# EAGLE design Protocell_module (EAGLE 7.1.0)
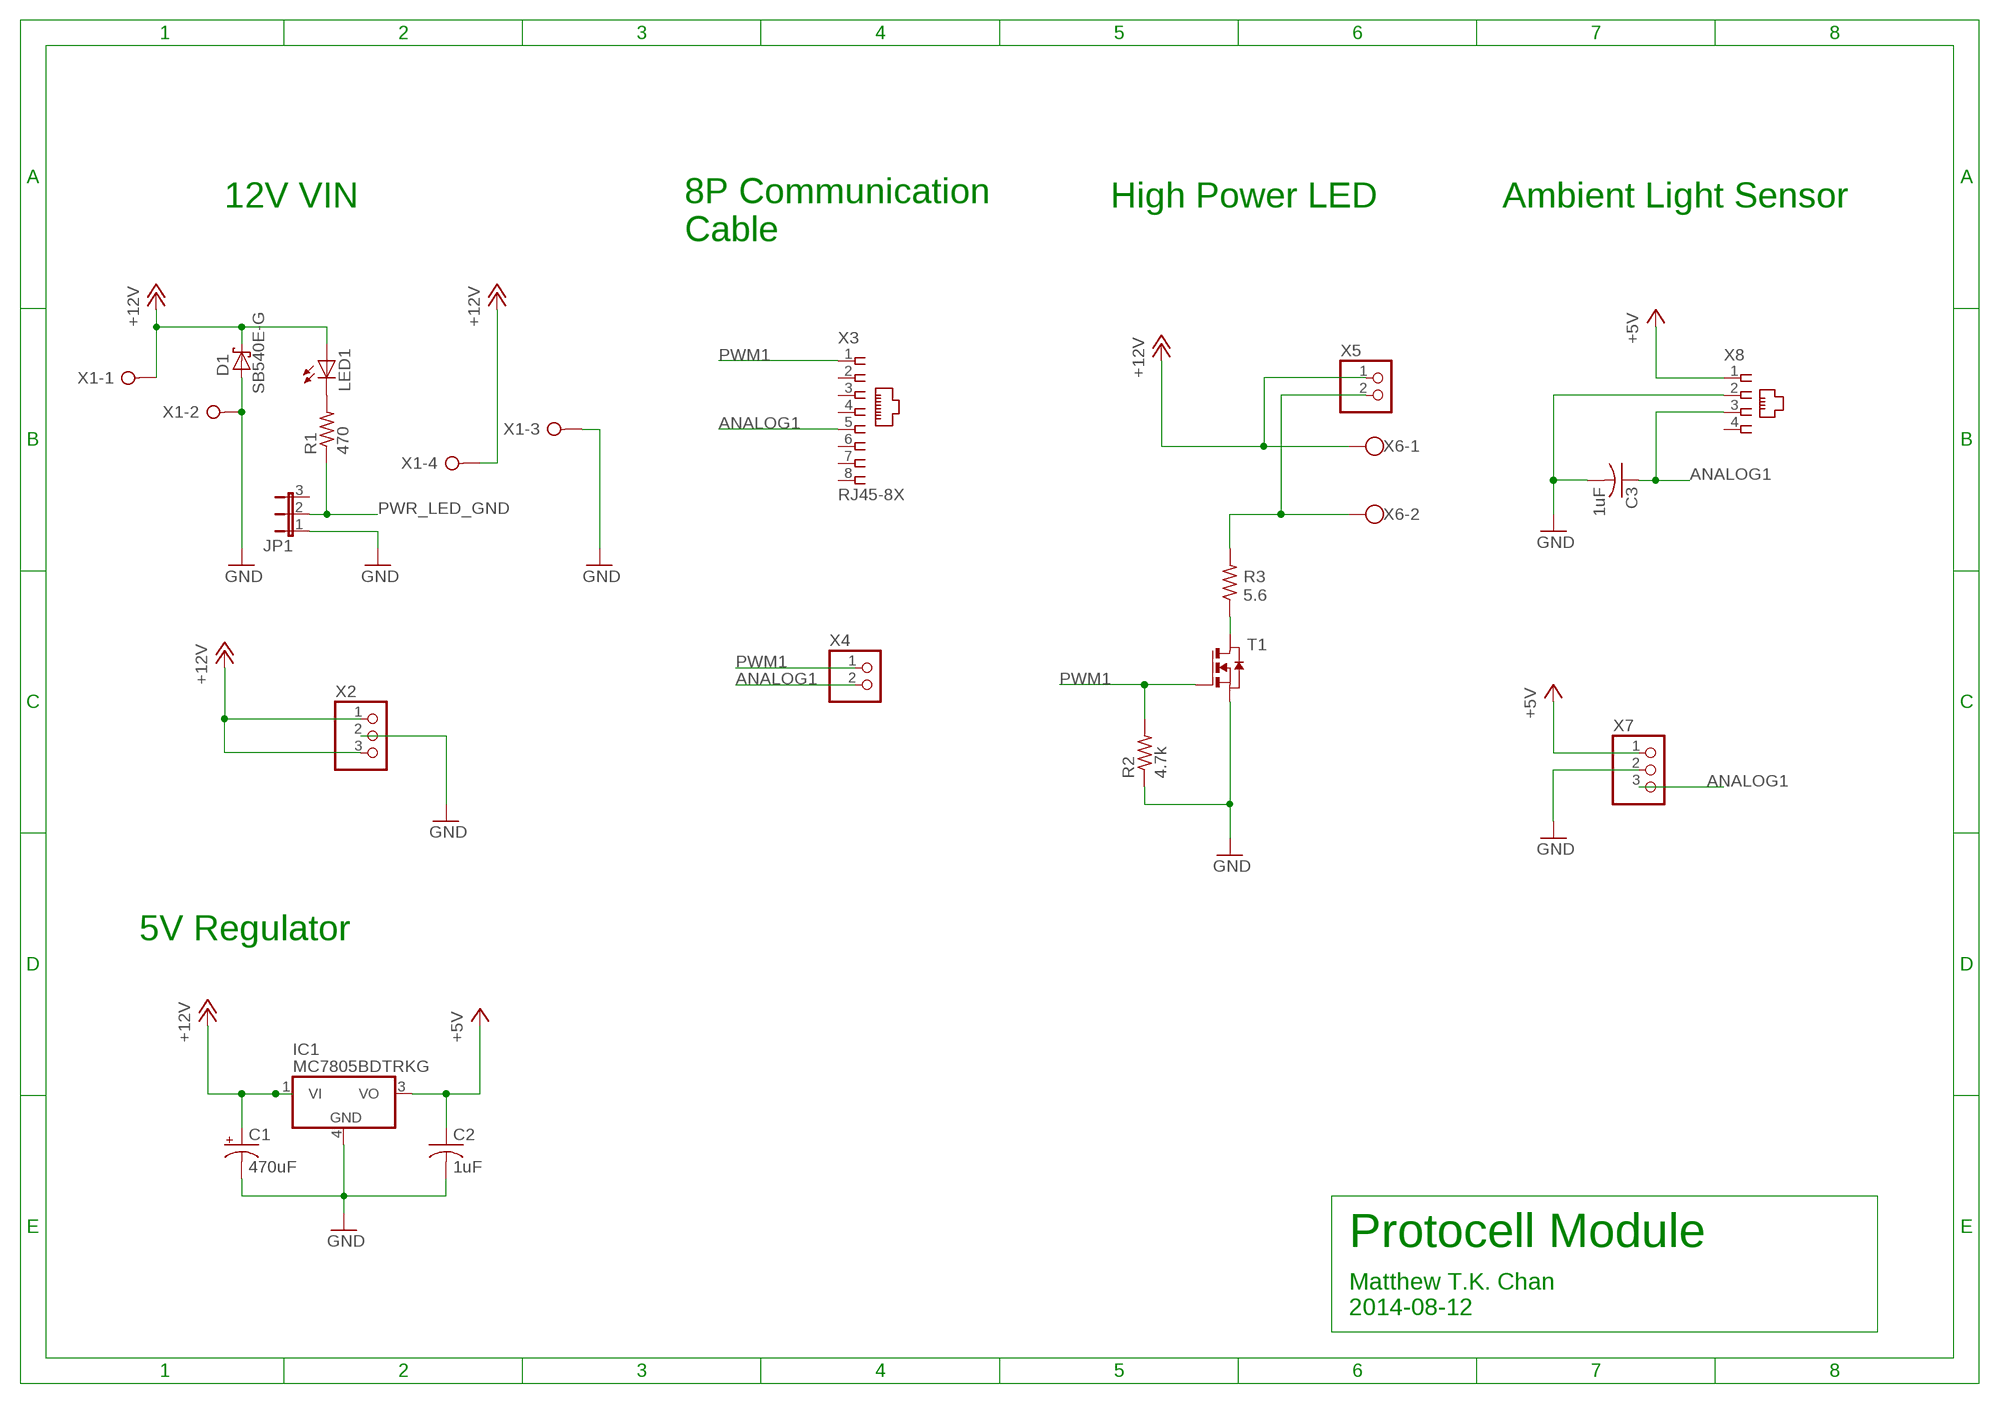
[diagram p0: schematic, sheet 1]

## Parts
C1  470uF  CPOL-USE5-10.5  [E5-10,5]
C2  1uF  C-USC0603  [C0603]
C3  1uF  C-USC0603  [C0603]
D1  SB540E-G  [DO201T15]
IC1  MC7805BDTRKG  [DPACK_3]
JP1  JP2E  [JP2]
LED1  LEDSML1206  [SML1206]
R1  470  R-US_R0603  [R0603]
R2  4.7k  R-US_R0603  [R0603]
R3  5.6  SQP500JB-5R6  [YAGEO_SQP500JB]
T1  NTD5867NLT4G  [DPACK]
X1  W237-04P  [W237-4P]
X2  PINHD-1X3/90  [1X03/90]
X3  RJ45-8X  [RJ45-NO-SHIELD]
X4  PINHD-1X2/90  [1X02/90]
X5  PINHD-1X2/90  [1X02/90]
X6  W237-102  [W237-102]
X7  PINHD-1X3/90  [1X03/90]
X8  558872-1  [558872-1]

## Nets
+5V: C2.1 IC1.3(VO) X7.1 X8.1
+12V: C1.+ D1.C IC1.1(VI) LED1.A X1.1 X1.4 X2.1 X2.3 X5.1 X6.1
ANALOG1: C3.1 X3.5 X4.2 X7.3 X8.3
GND: C1.- C2.2 C3.2 D1.A IC1.4(GND) JP1.1 R2.1 T1.3(S) X1.2 X1.3 X2.2 X7.2 X8.2
N$1: R3.1 T1.2(D)
N$3: R3.2 X5.2 X6.2
N$10: LED1.C R1.2
PWM1: R2.2 T1.1(G) X3.1 X4.1
PWR_LED_GND: JP1.2 R1.1
Unconnected: JP1.3 X3.2 X3.3 X3.4 X3.6 X3.7 X3.8 X8.4

## Notes on the sheet
- 12V VIN | High Power LED | Ambient Light Sensor
- 8P Communication 
  Cable
- 5V Regulator
- Protocell Module
- Matthew T.K. Chan
  2014-08-12

## Library data of the parts
C1 = rcl:CPOL-US: POLARIZED CAPACITOR, American symbol
C2 C3 = rcl:C-US: CAPACITOR, American symbol
D1 = CBLA_Test_bed_Library:SB540E-G: SCHOTTKY BARRIER RECTIFIER 3.0 AMPERES 20, 30, 40 VOLT Source: MBRS340T3-D.pdf
IC1 = CBLA_Test_bed_Library:MC78: 1A Positive Voltage Regulators Source: Data sheet <http://www.onsemi.com/pub_link/Collateral/MC7800-D.PDF>
JP1 = jumper:JP2E: JUMPER
LED1 = led:LED: LED OSRAM: - CHIPLED LG R971, LG N971, LY N971, LG Q971, LY Q971, LO R971, LY R971 LH N974, LH R974 LS Q976, LO Q976, LY Q976 LO Q996 - Hyper CHIPLED LW Q18S LB Q993, LB Q99A, LB R99A - SideLED LS A670, LO A670, LY A670, LG A670, LP A670 LB A673, LV A673, LT A673, LW A673 LH A674 LY A675 LS A676, LA A676, LO A676, LY A676, LW A676 LS A679, LY A679, LG A679 - Hyper Micro SIDELED® LS Y876, LA Y876, LO Y876, LY Y876 LT Y87S - SmartLED LW L88C, LW L88S LB L89C, LB L89S, LG L890 LS L89K, LO L89K, LY L89K LS L896, LA L896, LO L896, LY L896 - TOPLED LS T670, LO T670, LY T670, LG T670, LP T670 LSG T670, LSP T670, LSY T670, LOP T670, LYG T670 LG T671, LOG T671, LSG T671 LB T673, LV T673, LT T673, LW T673 LH T674 LS T676, LA T676, LO T676, LY T676, LB T676, LH T676, LSB T676, LW T676 LB T67C, LV T67C, LT T67C, LS T67K, LO T67K, LY T67K, LW E67C LS E67B, LA E67B, LO E67B, LY E67B, LB E67C, LV E67C, LT E67C LW T67C LS T679, LY T679, LG T679 LS T770, LO T770, LY T770, LG T770, LP T770 LB T773, LV T773, LT T773, LW T773 LH T774 LS E675, LA E675, LY E675, LS T675 LS T776, LA T776, LO T776, LY T776, LB T776 LHGB T686 LT T68C, LB T68C - Hyper Mini TOPLED® LB M676 - Mini TOPLED Santana® LG M470 LS M47K, LO M47K, LY M47K Source: http://www.osram.convergy.de LUXEON: - LUMILED® LXK2-PW12-R00, LXK2-PW12-S00, LXK2-PW14-U00, LXK2-PW14-V00 LXK2-PM12-R00, LXK2-PM12-S00, LXK2-PM14-U00 LXK2-PE12-Q00, LXK2-PE12-R00, LXK2-PE12-S00, LXK2-PE14-T00, LXK2-PE14-U00 LXK2-PB12-K00, LXK2-PB12-L00, LXK2-PB12-M00, LXK2-PB14-N00, LXK2-PB14-P00, LXK2-PB14-Q00 LXK2-PR12-L00, LXK2-PR12-M00, LXK2-PR14-Q00, LXK2-PR14-R00 LXK2-PD12-Q00, LXK2-PD12-R00, LXK2-PD12-S00 LXK2-PH12-R00, LXK2-PH12-S00 LXK2-PL12-P00, LXK2-PL12-Q00, LXK2-PL12-R00 Source: www.luxeon.com KINGBRIGHT: KA-3528ASYC Source: www.kingbright.com
R1 R2 = CBLA_Test_bed_Library:R-US_: RESISTOR, American symbol
R3 = CBLA_Test_bed_Library:SQP500
T1 = CBLA_Test_bed_Library:NTD5867NL: MOS FET
X1 = con-wago-508:W237-04P: WAGO SREW CLAMP; OC_FARNELL: unknown; OC_NEWARK: unknown
X2 X7 = CBLA_Test_bed_Library:PINHD-1X3: PIN HEADER
X3 = CBLA_Test_bed_Library:RJ45: CORCOM Modular RJ Jacks No Shield Source: www.tycoelectronics.com .. ENG_DS_1654001_1099_RJ_L_0507.pdf; MPN: RJ45-8X; OC_FARNELL: unknown; OC_NEWARK: 16R6101
X4 X5 = CBLA_Test_bed_Library:PINHD-1X2: PIN HEADER
X6 = con-wago-500:W237-102: WAGO SCREW CLAMP; MPN: 237-102; OC_FARNELL: unknown; OC_NEWARK: 70K9898
X8 = CBLA_Test_bed_Library:558872-1: AMP connector; MF: TYCO ELECTRONICS; MPN: 5558872-1; OC_FARNELL: 1557674; OC_NEWARK: 42K7312

## Board
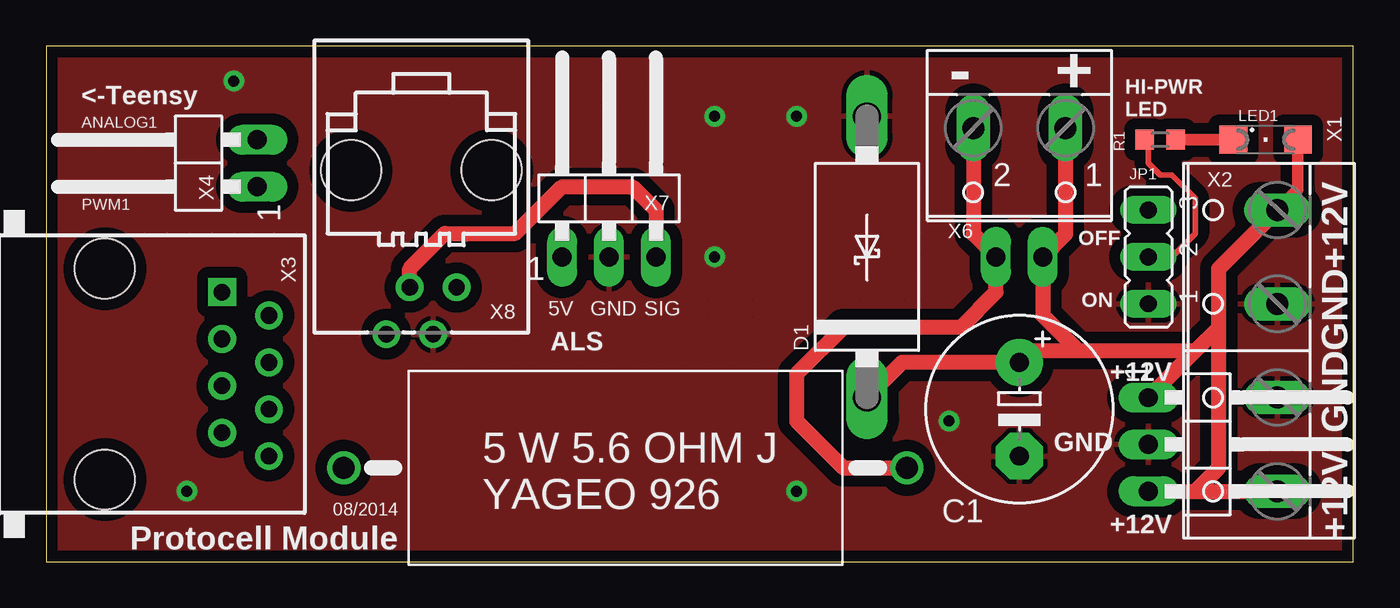
[diagram p1: board, top side]
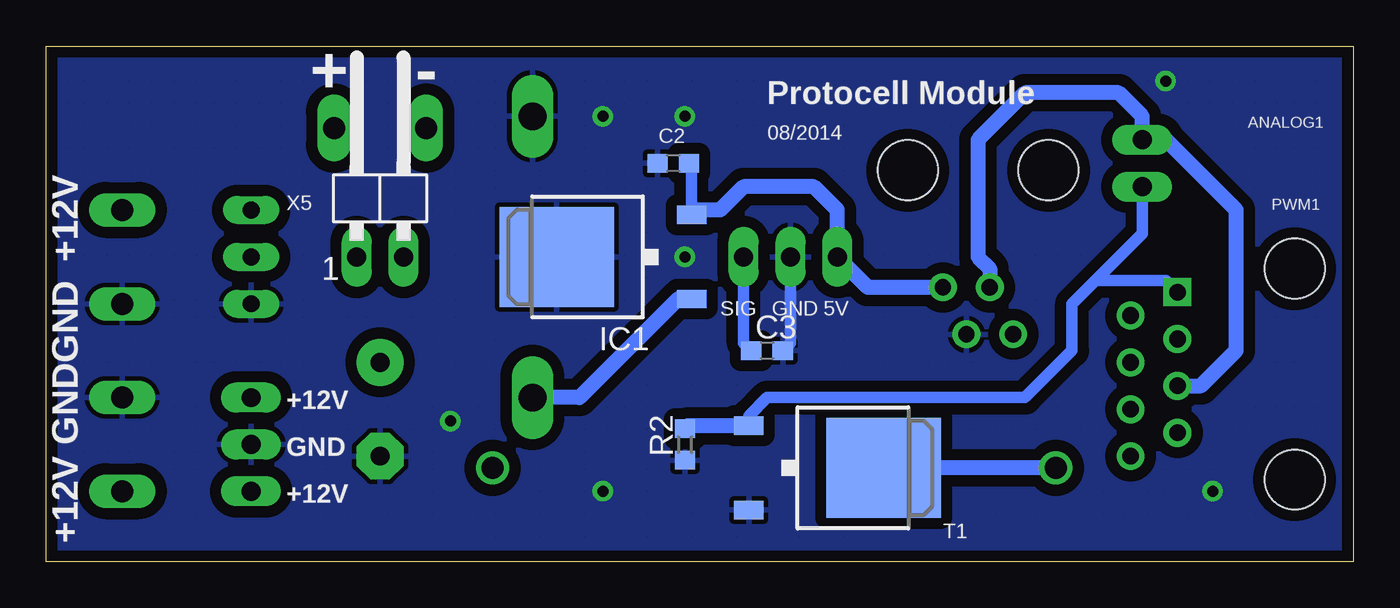
[diagram p2: board, bottom side, seen from below]

Size 70.79 x 27.93 mm. Coordinates in mm from the lower left corner, seen from the top.
Outline: 0,0 70.79,0 70.79,27.93 0,27.93 0,0
Copper layers (1*16): Top 0.035mm / dielectric 1.5mm / Bottom 0.035mm
Design rules "SparkFun": minimum track width 8mil, minimum drill 20mil, track to track 8mil, track to pad 8mil, pad to pad 8mil, via to via 8mil, smd to smd 8mil, copper to edge 10mil, drill to drill 8mil, minimum pad ring 12mil, minimum via ring 10mil, stop-mask expansion 4mil, vias tented up to drill 25mil, thermal gap 10mil

### Footprints (pad centres in the part's own frame; a part is rotated, then mirrored left to right if it is on the bottom)
E5-10,5 = drill 1.016 pad 2.54: + -2.54,0 | drill 1.016 pad 2.54 octagon: - 2.54,0
C0603 = smd 1.1 x 1: 1 -0.85,0; 2 0.85,0
DO201T15 = drill 1.499 long: A 7.62,0; C -7.62,0
DPACK_3 = smd 1 x 1.6: 1 -2.28,-4.8; 3 2.28,-4.8 | smd 5.4 x 6.2: 4 0,2.5
JP2 = drill 0.914 long: 1 -2.54,0; 2 0,0; 3 2.54,0
SML1206 = smd 1.5 x 1.5: A 1.75,0; C -1.75,0
R0603 = smd 1 x 1.1: 1 -0.85,0; 2 0.85,0
YAGEO_SQP500JB = drill 1.2: 1 -15,0; 2 15.5,0
DPACK = smd 1 x 1.6: 1 -2.28,-4.8; 3 2.28,-4.8 | smd 5.4 x 6.2: 2 0,2.5
W237-4P = drill 1.194 long: 1 -7.62,-0.635; 2 -2.54,-0.635; 3 2.54,-0.635; 4 7.62,-0.635
1X03/90 = drill 1.016 long: 1 -2.54,-3.81; 2 0,-3.81; 3 2.54,-3.81
RJ45-NO-SHIELD = drill 0.9 pad 1.4 square: 1 -4.445,6.35 | drill 0.9 pad 1.4: 2 -3.175,8.89; 3 -1.905,6.35; 4 -0.635,8.89; 5 0.635,6.35; 6 1.905,8.89; 7 3.175,6.35; 8 4.445,8.89 | hole 3.251: -5.715,0; 5.715,0
1X02/90 = drill 1.016 long: 1 -1.27,-3.81; 2 1.27,-3.81
W237-102 = drill 1.194 long: 1 -2.5,-1.27; 2 2.5,-1.27
558872-1 = drill 0.889: 1 -1.905,5.461; 2 -0.635,8.001; 3 0.635,5.461; 4 1.905,8.001 | hole 3.251: -3.81,-0.889; 3.81,-0.889

### Placement (x,y rotation side)
C1  52.7,8.26 270 top
C2  36.83,21.59 180 bottom
C3  31.75,11.43 0 bottom
D1  44.45,16.51 90 top
IC1  40.64,16.51 90 bottom
JP1  59.69,16.51 90 top
LED1  66.04,22.86 0 top
R1  60.33,22.86 0 top
R2  36.2,6.35 90 bottom
R3  31.11,5.08 0 top
T1  27.94,5.08 270 bottom
X1  66.04,11.43 90 top
X2  63.5,6.35 270 top
X3  3.17,10.16 270 top
X4  7.62,21.59 90 top
X5  52.7,20.32 0 bottom
X6  52.7,22.23 180 top
X7  30.48,20.32 0 top
X8  20.32,20.32 180 top

### Tracks (layer width: path | path; a pad name or v marks a point on that pad's centre or on a via)
+5V
  Bottom 0.61: IC1.3 35.84,21.45 C2.1
  Bottom 0.813: X8.1 26.29,14.86 X7.1 27.94,19.05 29.21,20.32 33.02,20.32 34.29,19.05 35.58,19.05 IC1.3
+12V
  Top 0.61: X1.4 67.79,20.16 LED1.A
  Top 0.813: X2.1 62.23,11.43 | 55.88,11.43 53.34,11.43 C1.+ 46.35,10.79 D1.C | 55.88,11.43 62.23,11.43 | 55.88,11.43 53.98,13.34 X5.1 55.2,17.74 X6.1 | X1.1 X2.3 62.23,3.81 63.5,5.08 63.5,12.7 | 63.5,12.7 63.5,15.88 X1.4 | 62.23,11.43 63.5,12.7
  Bottom 0.813: IC1.1 36.57,14.23 41.91,8.89 D1.C
ANALOG1
  Top 0.813: X8.3 19.68,15.88 21.59,17.78 25.4,17.78 27.94,20.32 31.75,20.32 33.02,19.05 X7.3
  Bottom 0.61: C3.1 33.02,11.85 X7.3
  Bottom 0.813: X3.5 8.26,9.53 6.35,11.43 6.35,19.05 10.16,22.86 X4.2 11.43,24.13 12.7,25.4 17.78,25.4 20.32,22.86 20.32,16.51 19.68,15.88 X8.3
GND  (via drill 0.6)
  Bottom 0.61: X7.2 30.48,11.85 C3.2
  other vias: 36.2,24.13 40.64,24.13 40.64,3.81 48.9,7.62 36.2,16.51 10.16,26.04 7.62,3.81
  pour Top (isolate 0.61, hatched): 0,27.94 0,0 71.12,0 71.12,27.94
  pour Bottom (isolate 0.61, hatched): 0,27.94 0,0 71.12,0 71.12,27.94
N$1
  Bottom 0.813: R3.1 T1.2
N$3
  Top 0.813: R3.2 43.18,5.08 40.64,7.62 40.64,10.16 43.18,12.7 49.53,12.7 51.44,14.61 X5.2 50.2,17.74 X6.2
N$10
  Top 0.61: R1.2 LED1.C
PWM1
  Bottom 0.61: T1.1 32.74,7.9 31.75,8.89 17.78,8.89 15.24,11.43 15.24,13.97 13.97,15.24 | 13.97,15.24 10.16,15.24 X3.1 | X4.1 11.43,17.78 13.97,15.24
  Bottom 0.813: T1.1 36.03,7.36 R2.2
PWR_LED_GND
  Top 0.305: R1.1 59.69,22.64 59.69,21.59 60.33,20.95 60.96,20.95 62.23,19.68 62.23,17.78 60.96,16.51 JP1.2

### Text on the board
tPlace: <-Teensy | - | + | HI-PWR / LED | ANALOG1 | PWM1 | OFF | +12V | ON | 5V | GND | SIG | ALS | +12V | GND | GND | GND | 08/2014 | +12V | Protocell Module | +12V
bPlace: Protocell Module | - | + | ANALOG1 | 08/2014 | +12V | PWM1 | GND | 5V | GND | SIG | GND | +12V | GND | +12V | +12V